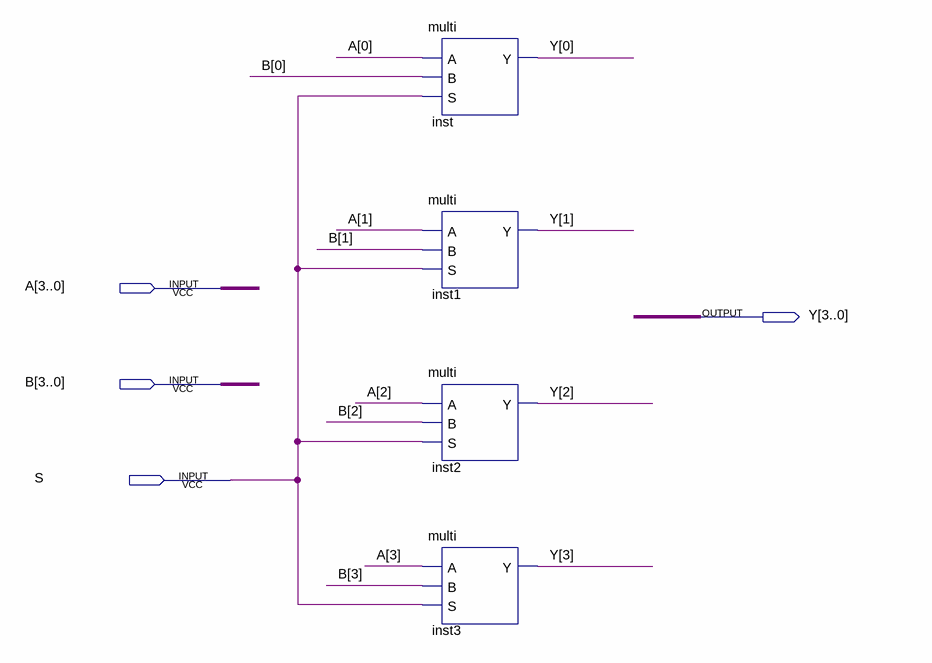
[diagram p0: schematic sheet]
// Quartus schematic four_multi.bdf as structural Verilog: 4 symbols, 4 pins
module four_multi (
  input  [3:0] A,
  input  [3:0] B,
  input  S,
  output [3:0] Y
);

  multi inst (.A(A[0]), .B(B[0]), .S(S), .Y(Y[0]));
  multi inst1 (.A(A[1]), .B(B[1]), .S(S), .Y(Y[1]));
  multi inst2 (.A(A[2]), .B(B[2]), .S(S), .Y(Y[2]));
  multi inst3 (.A(A[3]), .B(B[3]), .S(S), .Y(Y[3]));
endmodule
